# Altium project VCU.PrjPcb (part 2 of 2)

## Sheet Supply.SchDoc
size A4; SheetNumber: 6; SheetTotal: 7
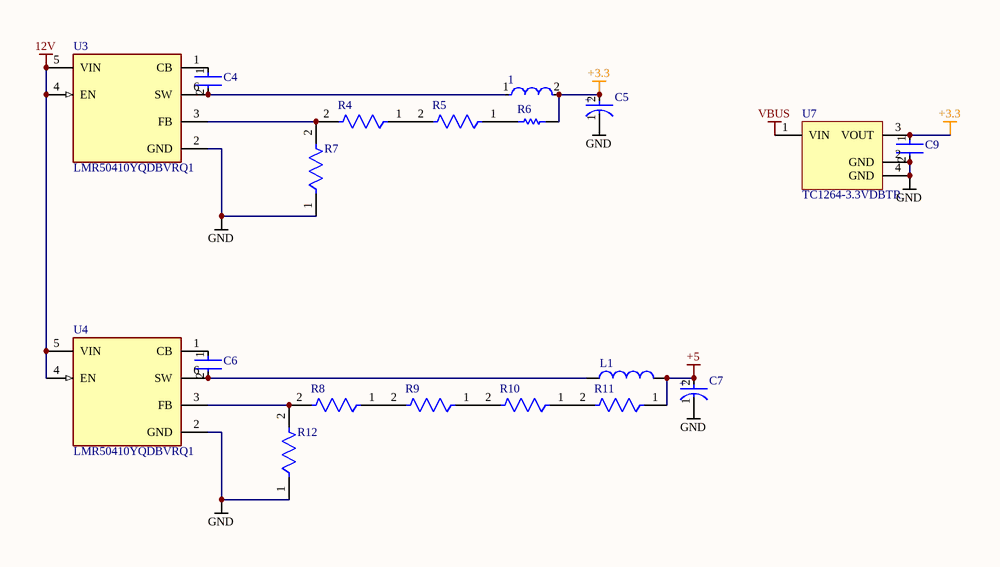
[diagram p5: Supply.SchDoc]

### Parts
1  LQM2HPN3R3MGCL  [FP-LQM2HPN_G0-IPC_B]  (value not drawn)
C4  GRM033R60J104KE19D  [FP-GRM033-0_03-MFG]  (value not drawn)
C5  EEE1VA100SR  [FP-SC-MFG]  (value not drawn)
C6  GRM033R60J104KE19D  [FP-GRM033-0_03-MFG]  (value not drawn)
C7  EEE1VA100SR  [FP-SC-MFG]  (value not drawn)
C9  GRM033R60J104KE19D  [FP-GRM033-0_03-MFG]  (value not drawn)
L1  74479887247A  [WE-PMI_1008_L2.5W2H1]  (value not drawn)
R4  ERA2AEB223X  [FP-ERA2A-IPC_A]  (value not drawn)
R5  ERA2AEB223X  [FP-ERA2A-IPC_A]  (value not drawn)
R6  RC0603FR-076K8L  [RESC1608X55X25ML10T15]  (value not drawn)
R7  ERA2AEB223X  [FP-ERA2A-IPC_A]  (value not drawn)
R8  ERA2AEB223X  [FP-ERA2A-IPC_A]  (value not drawn)
R9  ERA2AEB223X  [FP-ERA2A-IPC_A]  (value not drawn)
R10  ERA2AEB223X  [FP-ERA2A-IPC_A]  (value not drawn)
R11  ERA2AEB223X  [FP-ERA2A-IPC_A]  (value not drawn)
R12  ERA2AEB223X  [FP-ERA2A-IPC_A]  (value not drawn)
U3  LMR50410YQDBVRQ1  [FP-DBV0006A-MFG]
U4  LMR50410YQDBVRQ1  [FP-DBV0006A-MFG]
U7  TC1264-3.3VDBTR  [SOT-223-DB3_N]

### Nets
12V: U3.4(EN) U3.5(VIN) U4.4(EN) U4.5(VIN)
+3.3: 1.2 C5.2(A) C9.1 R6.2 U7.3(VOUT)
+5: C7.2(A) L1.2 R11.1
GND: C5.1(C) C7.1(C) C9.2 R7.1 R12.1 U3.2(GND) U4.2(GND) U7.2(GND) U7.4(GND)
VBUS: U7.1(VIN)
Net1_1: 1.1 C4.2 U3.6(SW)
NetC4_1: C4.1 U3.1(CB)
NetC6_1: C6.1 U4.1(CB)
NetC6_2: C6.2 L1.1 U4.6(SW)
NetR4_1: R4.1 R5.2
NetR4_2: R4.2 R7.2 U3.3(FB)
NetR5_1: R5.1 R6.1
NetR8_1: R8.1 R9.2
NetR8_2: R8.2 R12.2 U4.3(FB)
NetR9_1: R9.1 R10.2
NetR10_1: R10.1 R11.2

### Notes on the sheet
- (in symbol CMP-05427-000087-1) +

### Library data of the parts
1 = CMP-06042-016451-1: Multilayer Type Inductor for Power Lines, 1008 (2520), 3.3μH, 20%, 0.2Ω, 1000mA; Max DC Current: 1A; Shielding: Shielded; Test Frequency: 1MHz; DC Resistance (DCR): 200mR; Self Resonant Frequency: 30MHz; Inductance: 3.3uH; Core Material: Ferrite; Case/Package: 1008; Height: 0.9mm; Series: LQM2HP_GC; Case Code (Metric): 2520; Package Quantity: 3000; Current Rating: 1A; Max Operating Temperature: 125°C; Lead Free: Lead Free; Width: 0.079inch; Min Operating Temperature: -55°C; Mount: Surface Mount; Tolerance: 20%; Height - Seated (Max): 0.039inch; Depth: 2.2mm; RoHS Compliant: Yes; Termination: SMD/SMT; Radiation Hardening: No; Length: 2.5mm; Case Code (Imperial): 1008; Packaging: Tape and Reel
C4 C6 C9 = CMP-06035-000062-2: Chip Multilayer Ceramic Capacitors for General Purpose, 0201, 0.10uF, X5R, 15%, 10%, 6.3V; Capacitance: 100nF; Min Operating Temperature: -55°C; Lead Free: Lead Free; Radiation Hardening: No; Dielectric: X5R; Voltage Rating (DC): 6.3V; REACH SVHC: No SVHC; Case/Package: 0201; Voltage Rating: 6.3V; Length: 0.6mm; Max Operating Temperature: 85°C; Width: 0.012inch; Depth: 0.3mm; Material: Ceramic; Case Code (Metric): 0603; Thickness: 0.013inch; Packaging: Tape and Reel; Height: 0.3mm; Weight: 6E-06oz; Package Quantity: 1; Mount: Surface Mount; Voltage: 6.3V; Case Code (Imperial): 0201; Tolerance: 10%; Termination: SMD/SMT
C5 C7 = CMP-05427-000087-1: CAP ALUM 10UF 20% 35V SMD; Life (Hours): 2000Hour; Lead Length: 2.2mm; Ripple Current (AC): 30mA; Leakage Current: 3uA; Length: 5.5mm; Construction: Cylindrical; Diameter: 5mm; RoHS Compliant: Yes; REACH SVHC: No SVHC; Capacitance: 10uF; Max Operating Temperature: 85°C; Series: S; Case/Package: Radial; Contact Plating: Tin; Packaging: Tape and Reel; Voltage Rating: 35V; Number of Pins: 2; Height: 5.4mm; Width: 5.3mm; Voltage Rating (DC): 35V; Mount: Surface Mount; Tolerance: 20%; Lead Pitch: 1.5mm; Radiation Hardening: No; Height - Seated (Max): 0.213inch; Ripple Current: 30mA; Voltage: 35V; Package Quantity: 1; Termination: SMD/SMT; Min Operating Temperature: -40°C
L1 = CMP-1392-00007-2: NexarPartId: 29436167; DC Resistance (DCR): 230mΩ; Q Factor: 23; Inductance Tolerance: 20%; Max DC Current: 1A; Self Resonant Frequency: 45MHz; Inductance: 4.7µH; Test Frequency: 1MHz; Core Material: Ferrite; Saturation Current: 400mA; Shielding: Shielded; REACH SVHC: Unknown; Number of Pins: 2; Mount: Surface Mount; Tolerance: 20%; Min Operating Temperature: -40°C; Packaging: Digi-Reel®; Lead Free: Lead Free; Resistance: 230MΩ; Ambient Temperature Range High: 85°C; Ambient Temperature Range Low: -40°C; Case Code (Imperial): 1008; Current Rating: 1A; Width: 2mm; Max Operating Temperature: 125°C; Height: 800µm; RoHS: Compliant; Length: 2.5mm; Case/Package: SMD/SMT; Termination: SMD/SMT; Height - Seated (Max): 990.6µm; Case Code (Metric): 2520
R4 R5 R7-R12 = CMP-2002-05882-2: RES SMD 22K OHM 0.1% 1/16W 0402; Power Rating: 62.5mW; Voltage Rating: 50V; Temperature Coefficient: 25ppm/°C; Voltage Rating (DC): 25V; Resistance: 22kR; Max Power Dissipation: 63mW; Length: 1mm; Contact Plating: Tin; RoHS Compliant: Yes; Max Operating Temperature: 155°C; Termination: SMD/SMT; Depth: 0.5mm; Height: 0.35mm; Technology: THIN FILM; REACH SVHC: No SVHC; Width: 0.5mm; Mount: Surface Mount; Radiation Hardening: No; Min Operating Temperature: -55°C; Case Code (Metric): 1005; Packaging: Cut Tape; Weight: 2.8E-05oz; Package Quantity: 10000; Number of Terminations: 2; Series: ERA-xA; Number of Pins: 2; Military Standard: Not; Tolerance: 0.1%; Resistor Type: Metal Film; Lead Free: Lead Free; Case/Package: 0402; Case Code (Imperial): 0402; Features: Automotive AEC-Q200
R6 = CMP-1659-00046-1: Chip Resistor, 6.8 KOhm, +/- 1%, 100 mW, -55 to 155 degC, 0603 (1608 Metric), RoHS, Tape and Reel; Shielding: Unshielded; Gender: Female; Current Rating: 2 A; Case\Package: Metal; Voltage Rating: 34 V; Colour: Black; ComponentLink2URL: http://www.yageo.com/documents/recent/PYu-RC_Group_51_RoHS_L_04.pdf; REACH SVHC: Unknown; Package Quantity: 1; Height: 13 mm; Contact Material: Copper; ComponentLink1Description: Manufacturer URL; Min Operating Temperature: -25 degC; RoHSCompliant: true; ComponentLink2Description: Datasheet; PackageReference: 0603; Length: 19.5 mm; Pins: 1; Contact Plating: Silver; PackageDescription: 2-Pin Surface Mount Device, Body 1.6 x 0.8 mm; Max Operating Temperature: 85 degC; Mount: Through Hole; DatasheetVersion: Rev. 4, 02/2016; Width: 10 mm; ComponentLink1URL: http://www.yageo.com/
U3 U4 = CMP-04918-000478-1: NIXON PLUS-LMR50410YQDBVRQ1
U7 = CMP-0136-00429-1: 800 mA Fixed-Output CMOS LDO with Shutdown, 3-Pin SOT-223, Extended Temperature, Tape and Reel; PackageVersion: revBB, Aug-2009; PackageDescription: 3-Lead Plastic Small Outline Transistor (DB) [SOT-223]; PackageReference: SOT-223-DB3; DatasheetVersion: revC, Oct-2006

## Sheet Connector.SchDoc
size A4; SheetNumber: 7; SheetTotal: 7
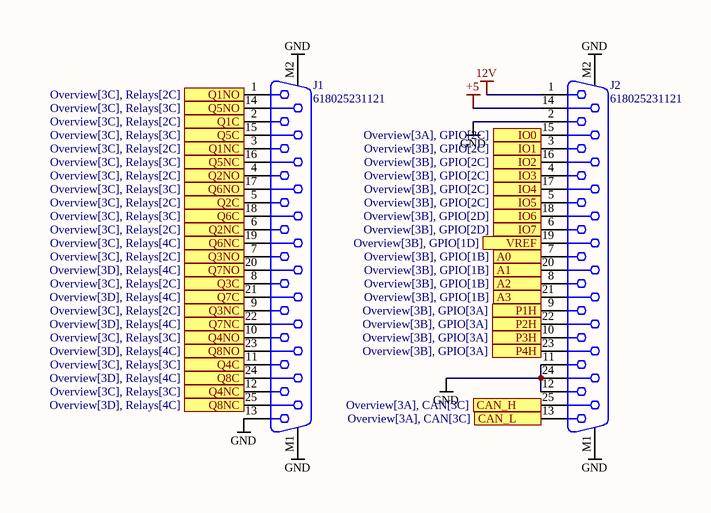
[diagram p6: Connector.SchDoc]

### Parts
J1  618025231121  [618025231121]
J2  618025231121  [618025231121]

### Ports
A0 (see Overview[3B], GPIO[1B]), A1 (see Overview[3B], GPIO[1B]), A2 (see Overview[3B], GPIO[1B]), A3 (see Overview[3B], GPIO[1B]), CAN_H (see Overview[3A], CAN[3C]), CAN_L (see Overview[3A], CAN[3C]), IO0 (see Overview[3A], GPIO[2C]), IO1 (see Overview[3B], GPIO[2C]), IO2 (see Overview[3B], GPIO[2C]), IO3 (see Overview[3B], GPIO[2C]), IO4 (see Overview[3B], GPIO[2C]), IO5 (see Overview[3B], GPIO[2C]), IO6 (see Overview[3B], GPIO[2D]), IO7 (see Overview[3B], GPIO[2D]), P1H (see Overview[3B], GPIO[3A]), P2H (see Overview[3B], GPIO[3A]), P3H (see Overview[3B], GPIO[3A]), P4H (see Overview[3B], GPIO[3A]), Q1C (see Overview[3C], Relays[2C]), Q1NC (see Overview[3C], Relays[2C]), Q1NO (see Overview[3C], Relays[2C]), Q2C (see Overview[3C], Relays[2C]), Q2NC (see Overview[3C], Relays[2C]), Q2NO (see Overview[3C], Relays[2C]), Q3C (see Overview[3C], Relays[2C]), Q3NC (see Overview[3C], Relays[2C]), Q3NO (see Overview[3C], Relays[2C]), Q4C (see Overview[3C], Relays[3C]), Q4NC (see Overview[3C], Relays[3C]), Q4NO (see Overview[3C], Relays[3C]), Q5C (see Overview[3C], Relays[3C]), Q5NC (see Overview[3C], Relays[3C]), Q5NO (see Overview[3C], Relays[3C]), Q6C (see Overview[3C], Relays[3C]), Q6NC (see Overview[3C], Relays[4C]), Q6NO (see Overview[3C], Relays[3C]), Q7C (see Overview[3D], Relays[4C]), Q7NC (see Overview[3D], Relays[4C]), Q7NO (see Overview[3D], Relays[4C]), Q8C (see Overview[3D], Relays[4C]), Q8NC (see Overview[3D], Relays[4C]), Q8NO (see Overview[3D], Relays[4C]), VREF (see Overview[3B], GPIO[1D])

### Nets
12V: J2.1
+5: J2.14
GND: J1.13 J1.M1 J1.M2 J2.2 J2.11 J2.12 J2.24 J2.M1 J2.M2
NetJ1_1: J1.1 ; port Q1NO
NetJ1_2: J1.2 ; port Q1C
NetJ1_3: J1.3 ; port Q1NC
NetJ1_4: J1.4 ; port Q2NO
NetJ1_5: J1.5 ; port Q2C
NetJ1_6: J1.6 ; port Q2NC
NetJ1_7: J1.7 ; port Q3NO
NetJ1_8: J1.8 ; port Q3C
NetJ1_9: J1.9 ; port Q3NC
NetJ1_10: J1.10 ; port Q4NO
NetJ1_11: J1.11 ; port Q4C
NetJ1_12: J1.12 ; port Q4NC
NetJ1_14: J1.14 ; port Q5NO
NetJ1_15: J1.15 ; port Q5C
NetJ1_16: J1.16 ; port Q5NC
NetJ1_17: J1.17 ; port Q6NO
NetJ1_18: J1.18 ; port Q6C
NetJ1_19: J1.19 ; port Q6NC
NetJ1_20: J1.20 ; port Q7NO
NetJ1_21: J1.21 ; port Q7C
NetJ1_22: J1.22 ; port Q7NC
NetJ1_23: J1.23 ; port Q8NO
NetJ1_24: J1.24 ; port Q8C
NetJ1_25: J1.25 ; port Q8NC
NetJ2_3: J2.3 ; port IO1
NetJ2_4: J2.4 ; port IO3
NetJ2_5: J2.5 ; port IO5
NetJ2_6: J2.6 ; port IO7
NetJ2_7: J2.7 ; port A0
NetJ2_8: J2.8 ; port A2
NetJ2_9: J2.9 ; port P1H
NetJ2_10: J2.10 ; port P3H
NetJ2_13: J2.13 ; port CAN_L
NetJ2_15: J2.15 ; port IO0
NetJ2_16: J2.16 ; port IO2
NetJ2_17: J2.17 ; port IO4
NetJ2_18: J2.18 ; port IO6
NetJ2_19: J2.19 ; port VREF
NetJ2_20: J2.20 ; port A1
NetJ2_21: J2.21 ; port A3
NetJ2_22: J2.22 ; port P2H
NetJ2_23: J2.23 ; port P4H
NetJ2_25: J2.25 ; port CAN_H

### Library data of the parts
J1 J2 = CMP-1502-00202-2: NexarPartId: 18818207; Pitch: 2.77mm; Operating Supply Voltage: 125V; Gender: Female; Insulation Resistance: 5GΩ; Contact Resistance: 30mΩ; Current Rating: 3A; Number of Contacts: 25; Contact Plating: Gold; Width: 12.5mm; RoHS: Compliant; REACH SVHC: Unknown; Min Operating Temperature: -55°C; Termination: SMD/SMT; Voltage Rating: 125V; Mount: Through Hole; Housing Material: Steel; Insulation Material: PBT; Number of Rows: 2; Depth: 18.5mm; Orientation: Right Angle; Number of Pins: 25; Max Operating Temperature: 105°C; Length: 38.33mm

## Nets that join several sheets
12V: Relays (16 pins), Supply (U3.4 U3.5 U4.4 U4.5), Connector (J2.1)
+3.3: ESP32S3 (18 pins), GPIO (C8.1 U5.8 U6.9), Supply (5 pins)
+5: ESP32S3 (P2.1 P3.1), CAN (5 pins), GPIO (U6.1 U6.2 U6.3), Supply (C7.2 L1.2 R11.1), Connector (J2.14)
GND: ESP32S3 (36 pins), CAN (6 pins), Relays (8 pins), GPIO (8 pins), Supply (9 pins), Connector (9 pins)
VBUS: ESP32S3 (J3.A4_B9 J3.B4_A9 P1.1), Supply (U7.1)
K1: ESP32S3 (U51.16), Relays (Q1.1)
K2: ESP32S3 (U51.17), Relays (Q5.1)
K3: ESP32S3 (U51.18), Relays (Q2.1)
K4: ESP32S3 (U51.19), Relays (Q6.1)
K5: ESP32S3 (U51.23), Relays (Q7.1)
K6: ESP32S3 (U51.24), Relays (Q3.1)
K7: ESP32S3 (U51.27), Relays (Q8.1)
K8: ESP32S3 (U51.38), Relays (Q4.1)
NetJ1_1: Relays (K1.14), Connector (J1.1)
NetJ1_2: Relays (K1.11), Connector (J1.2)
NetJ1_3: Relays (K1.12), Connector (J1.3)
NetJ1_4: Relays (K2.14), Connector (J1.4)
NetJ1_5: Relays (K2.11), Connector (J1.5)
NetJ1_6: Relays (K2.12), Connector (J1.6)
NetJ1_7: Relays (K3.14), Connector (J1.7)
NetJ1_8: Relays (K3.11), Connector (J1.8)
NetJ1_9: Relays (K3.12), Connector (J1.9)
NetJ1_10: Relays (K4.14), Connector (J1.10)
NetJ1_11: Relays (K4.11), Connector (J1.11)
NetJ1_12: Relays (K4.12), Connector (J1.12)
NetJ1_14: Relays (K5.14), Connector (J1.14)
NetJ1_15: Relays (K5.11), Connector (J1.15)
NetJ1_16: Relays (K5.12), Connector (J1.16)
NetJ1_17: Relays (K6.14), Connector (J1.17)
NetJ1_18: Relays (K6.11), Connector (J1.18)
NetJ1_19: Relays (K6.12), Connector (J1.19)
NetJ1_20: Relays (K7.14), Connector (J1.20)
NetJ1_21: Relays (K7.11), Connector (J1.21)
NetJ1_22: Relays (K7.12), Connector (J1.22)
NetJ1_23: Relays (K8.14), Connector (J1.23)
NetJ1_24: Relays (K8.11), Connector (J1.24)
NetJ1_25: Relays (K8.12), Connector (J1.25)
NetJ2_3: GPIO (U6.5), Connector (J2.3)
NetJ2_4: GPIO (U6.7), Connector (J2.4)
NetJ2_5: GPIO (U6.11), Connector (J2.5)
NetJ2_6: GPIO (U6.13), Connector (J2.6)
NetJ2_7: GPIO (U5.4), Connector (J2.7)
NetJ2_8: GPIO (U5.6), Connector (J2.8)
NetJ2_9: GPIO (R13.1), Connector (J2.9)
NetJ2_10: GPIO (R15.1), Connector (J2.10)
NetJ2_13: CAN (U2.6), Connector (J2.13)
NetJ2_15: GPIO (U6.4), Connector (J2.15)
NetJ2_16: GPIO (U6.6), Connector (J2.16)
NetJ2_17: GPIO (U6.10), Connector (J2.17)
NetJ2_18: GPIO (U6.12), Connector (J2.18)
NetJ2_19: GPIO (U6.8), Connector (J2.19)
NetJ2_20: GPIO (U5.5), Connector (J2.20)
NetJ2_21: GPIO (U5.7), Connector (J2.21)
NetJ2_22: GPIO (R14.1), Connector (J2.22)
NetJ2_23: GPIO (R16.1), Connector (J2.23)
NetJ2_25: CAN (U2.7), Connector (J2.25)
NetR13_2: ESP32S3 (U51.12), GPIO (R13.2 R17.2)
NetR14_2: ESP32S3 (U51.13), GPIO (R14.2 R18.2)
NetR15_2: ESP32S3 (U51.14), GPIO (R15.2 R19.2)
NetR16_2: ESP32S3 (U51.15), GPIO (R16.2 R20.2)
NetU1_14: ESP32S3 (U51.9), CAN (U1.14)
NetU1_16: ESP32S3 (U51.11), CAN (U1.16)
NetU1_17: ESP32S3 (U51.10), CAN (U1.17)
NetU1_18: ESP32S3 (U51.41), CAN (U1.18)
SCL: ESP32S3 (P3.5 R22.1 U51.7), GPIO (U5.10 U6.16)
SDA: ESP32S3 (P3.3 R21.1 U51.6), GPIO (U5.9 U6.15)